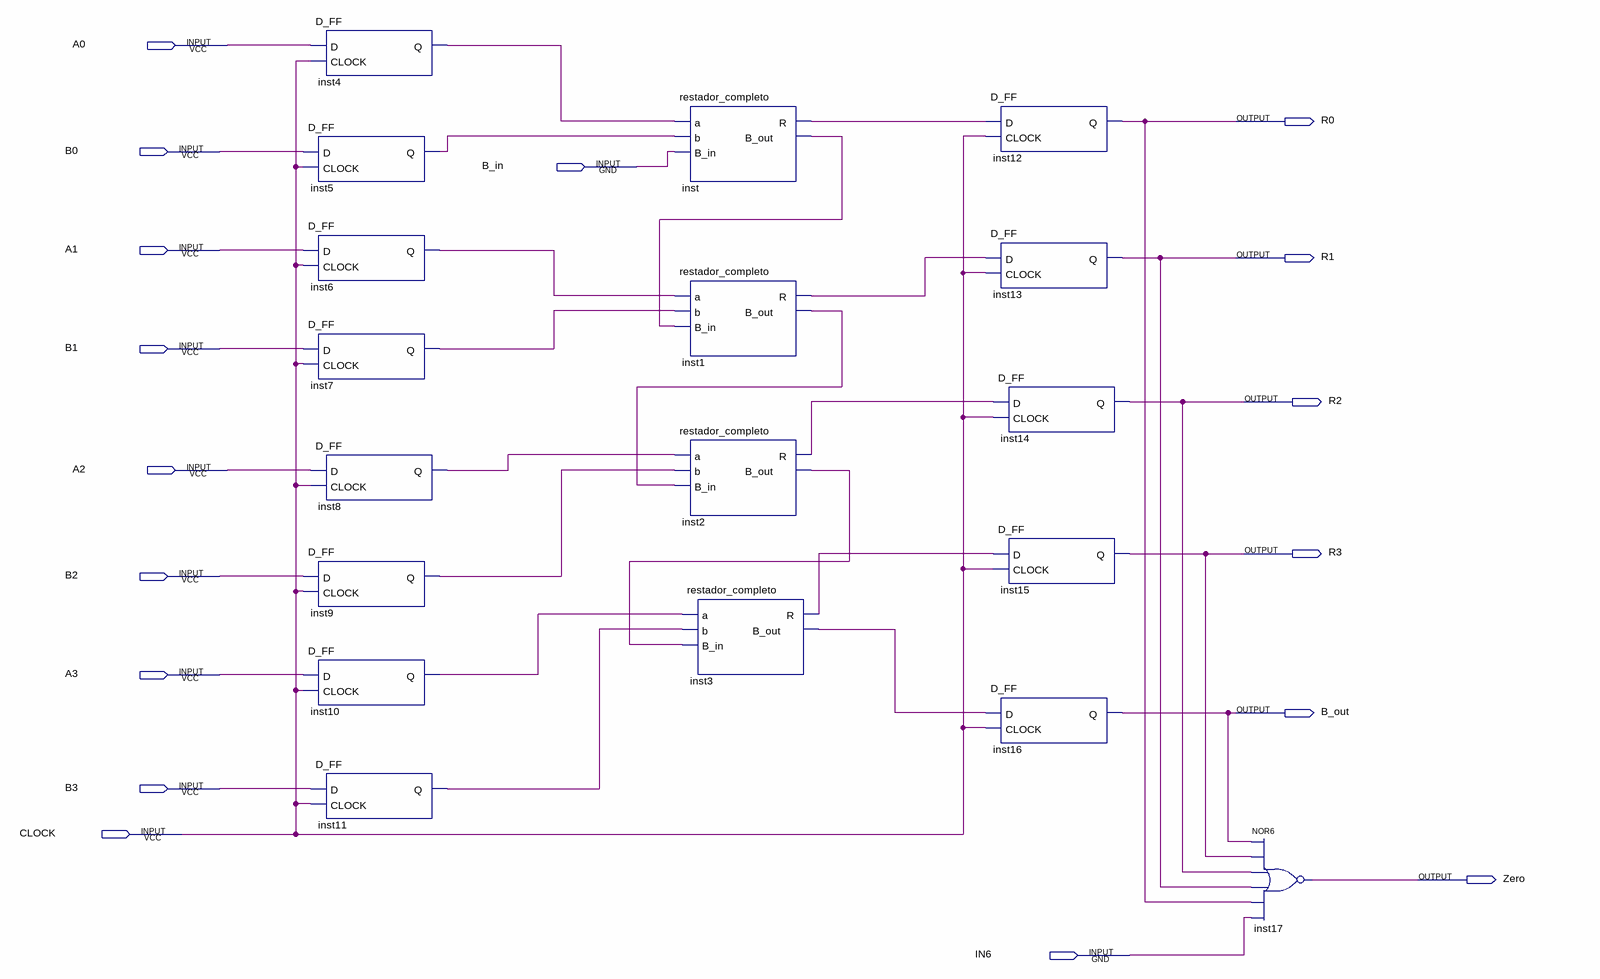
[diagram p0: schematic sheet]
// Quartus schematic restador_4_bits.bdf as structural Verilog: 18 symbols, 17 pins
module restador_4_bits (
  input  A0,
  input  B0,
  input  B_in,
  input  A1,
  input  B1,
  input  A2,
  input  B2,
  input  A3,
  input  B3,
  input  CLOCK,
  input  IN6,
  output R0,
  output R1,
  output R2,
  output R3,
  output B_out,
  output Zero
);

  wire inst1_b_out, inst1_r, inst2_b_out, inst2_r, inst3_b_out, inst3_r, inst4_q, inst5_q, inst6_q, inst7_q,
       inst8_q, inst9_q, inst10_q, inst11_q, inst_b_out, inst_r;

  D_FF inst4 (.D(A0), .CLOCK(CLOCK), .Q(inst4_q));
  D_FF inst5 (.D(B0), .CLOCK(CLOCK), .Q(inst5_q));
  D_FF inst6 (.D(A1), .CLOCK(CLOCK), .Q(inst6_q));
  D_FF inst7 (.D(B1), .CLOCK(CLOCK), .Q(inst7_q));
  D_FF inst8 (.D(A2), .CLOCK(CLOCK), .Q(inst8_q));
  D_FF inst9 (.D(B2), .CLOCK(CLOCK), .Q(inst9_q));
  D_FF inst10 (.D(A3), .CLOCK(CLOCK), .Q(inst10_q));
  D_FF inst11 (.D(B3), .CLOCK(CLOCK), .Q(inst11_q));
  restador_completo inst (.a(inst4_q), .b(inst5_q), .B_in(B_in), .R(inst_r), .B_out(inst_b_out));
  restador_completo inst1 (.a(inst6_q), .b(inst7_q), .B_in(inst_b_out), .R(inst1_r), .B_out(inst1_b_out));
  restador_completo inst2 (.a(inst8_q), .b(inst9_q), .B_in(inst1_b_out), .R(inst2_r), .B_out(inst2_b_out));
  restador_completo inst3 (.a(inst10_q), .b(inst11_q), .B_in(inst2_b_out), .R(inst3_r), .B_out(inst3_b_out));
  D_FF inst12 (.D(inst_r), .CLOCK(CLOCK), .Q(R0));
  D_FF inst13 (.D(inst1_r), .CLOCK(CLOCK), .Q(R1));
  D_FF inst14 (.D(inst2_r), .CLOCK(CLOCK), .Q(R2));
  D_FF inst15 (.D(inst3_r), .CLOCK(CLOCK), .Q(R3));
  D_FF inst16 (.D(inst3_b_out), .CLOCK(CLOCK), .Q(B_out));
  nor inst17 (Zero, B_out, R3, R2, R1, R0, IN6);
endmodule
